# Altium schematic sheet SNS_INPUT.SchDoc: {Наименование}
size 420 x 297 mm; ApprovedBy: {Утвердил}; CheckedBy: {Проверил}; DrawnBy: {Разраб.}; DocumentNumber: АБВГ 123456.789 00; SheetNumber: 9; SheetTotal: {}; Scale: {Мш.}; PageSetup: Record=PageOptions|CenterHorizontal=False|CenterVertical=False|PrintScale=0.95|XCorrection=0.00|YCorrection=0.00|PrintKind=1|BorderSize=5000000|LeftOffset=0|BottomOffset=0|Orientation=1|PaperLength=1000|PaperWidth=1000|Scale=100|PaperSource=15|PrintQuality=600|MediaType=1|DitherType=10|PaperKind=A4|PrintScaleMode=1; ProcessInspection: {Т.контр.}; Mass: {М.}; NormInspection: {Н.контр.}; Letter1Column: {}; Letter2Column: {}; Letter3Column: {}; DocumentType: {Документ}; Rule: PcbType=ProtelPcb
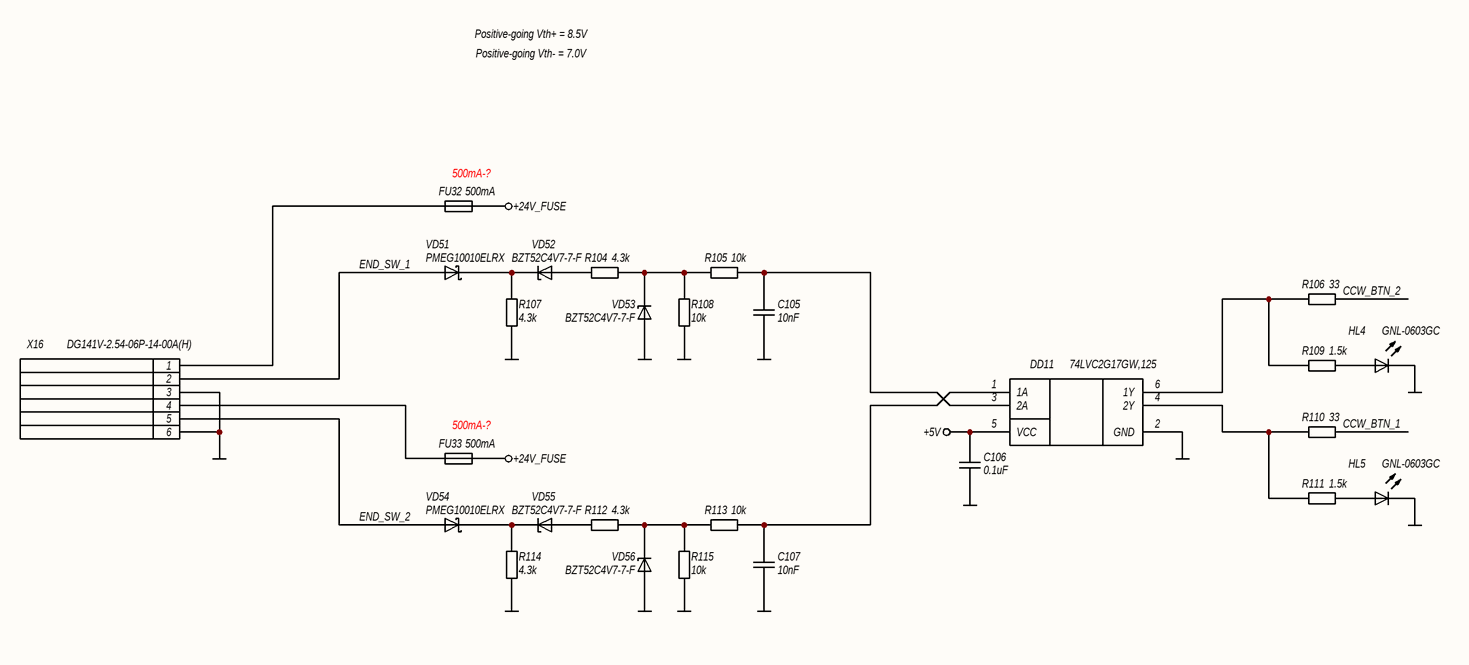
[diagram p0: SNS_INPUT.SchDoc]

## Parts
C105  10nF  [C0603N]
C106  0.1uF  [C0603N]
C107  10nF  [C0603N]
DD11  74LVC2G17GW,125  [SOT363-2]
FU32  500mA  [MF-MSMF]
FU33  500mA  [MF-MSMF]
HL4  GNL-0603GC  [LED0603]
HL5  GNL-0603GC  [LED0603]
R104  4.3k  [R1206N]
R105  10k  [R0603N]
R106  33  [R0603N]
R107  4.3k  [R1206N]
R108  10k  [R0603N]
R109  1.5k  [R0603N]
R110  33  [R0603N]
R111  1.5k  [R0603N]
R112  4.3k  [R1206N]
R113  10k  [R0603N]
R114  4.3k  [R1206N]
R115  10k  [R0603N]
VD51  PMEG10010ELRX  [SOD123W]
VD52  BZT52C4V7-7-F  [SOD123]
VD53  BZT52C4V7-7-F  [SOD123]
VD54  PMEG10010ELRX  [SOD123W]
VD55  BZT52C4V7-7-F  [SOD123]
VD56  BZT52C4V7-7-F  [SOD123]
X16  DG141V-2.54-06P-14-00A(H)  [DG141V-2.54-06P-14-00A(H)]

## Nets
+5V: C106.2 DD11.5(VCC)
+24V_FUSE: FU32.2 FU33.2
GND: C105.2 C106.1 C107.2 DD11.2(GND) HL4.1(K) HL5.1(K) R107.2 R108.2 R114.2 R115.2 VD53.2(A) VD56.2(A) X16.3 X16.6
CCW_BTN_1: R110.1
CCW_BTN_2: R106.1
END_SW_1: VD51.2(A) X16.2
END_SW_2: VD54.2(A) X16.5
NetC105_1: C105.1 DD11.3(2A) R105.1
NetC107_1: C107.1 DD11.1(1A) R113.1
NetDD11_4: DD11.4(2Y) R110.2 R111.2
NetDD11_6: DD11.6(1Y) R106.2 R109.2
NetFU32_1: FU32.1 X16.1
NetFU33_1: FU33.1 X16.4
NetHL4_2: HL4.2(A) R109.1
NetHL5_2: HL5.2(A) R111.1
NetR104_1: R104.1 R105.2 R108.1 VD53.1(K)
NetR104_2: R104.2 VD52.2(A)
NetR107_1: R107.1 VD51.1(K) VD52.1(K)
NetR112_1: R112.1 R113.2 R115.1 VD56.1(K)
NetR112_2: R112.2 VD55.2(A)
NetR114_1: R114.1 VD54.1(K) VD55.1(K)

## Notes on the sheet
- Positive-going Vth+ = 8.5V
- Positive-going Vth- = 7.0V
- (near FU32) 500mA-?
- (near FU33) 500mA-?
- Подп. и дата
- Инв. № дубл.
- Взам. инв. №
- Инв. № подл.
- Лист
- Изм.
- № докум.
- Подп.
- Дата
- Копировал
- Формат А3

## Library data of the parts
C105 C107 = CL10B103KB8NNNC: Конденсатор; Точность: 10%; Напряжение: 16V; Диэлектрик: X7R; Производитель: Samsung Electro-Mechanics; Описание: 10000 pF ±10% 50V Ceramic Capacitor X7R 0603 (1608 Metric); Корпус: 0603 (1608 Metric); Температурный диапазон: -55°C ~ 125°C; Вид монтажа: SMD; Артикул: CL10B103KB8NNNC; Номинал: 10nF; Строка для документации: https://mm.digikey.com/Volume0/opasdata/d220001/medias/docus/609/CL10B103KB8NNNC_Spec.pdf; Тип элемента: Конденсатор
C106 = CL10B104KB8NNNC: Конденсатор; Точность: 10%; Напряжение: 50V; Диэлектрик: X7R; Производитель: Samsung Electro-Mechanics; Описание: 0.1 µF ±10% 50V Ceramic Capacitor X7R 0603 (1608 Metric); Корпус: 0603 (1608 Metric); Температурный диапазон: -55°C ~ 125°C; Вид монтажа: SMD; Артикул: CL10B104KB8NNNC; Номинал: 0.1uF; Строка для документации: https://mm.digikey.com/Volume0/opasdata/d220001/medias/docus/609/CL10B104KB8NNNC_Spec.pdf; Тип элемента: Конденсатор
DD11 = 74LVC2G17GW,125: Микросхема сдвоенный триггер Шмитта; Производитель: Nexperia USA Inc.; Описание: Buffer, Non-Inverting 2 Element 1 Bit per Element Push-Pull Output 6-TSSOP; Корпус: 6-TSSOP; Температурный диапазон: -40°C ~ 125°C (TA); Вид монтажа: SMD; Артикул: 74LVC2G17GW,125; Строка для документации: https://assets.nexperia.com/documents/data-sheet/74LVC2G17.pdf; Тип элемента: Микросхема
FU32 FU33 = MF-MSMF050/40X-2: Плавкий предохранитель; Напряжение: 40V; Тип: PTC Resettable Fuse; Производитель: Bourns Inc.; Описание: Polymeric PTC Resettable Fuse 40V 500 mA Ih Surface Mount 1812 (4532 Metric), Concave; Корпус: 1812 (4532 Metric), Concave; Температурный диапазон: -40°C ~ 85°C; Вид монтажа: SMD; Артикул: MF-MSMF050/40X-2; Ток: 500mA; Строка для документации: https://www.bourns.com/docs/product-datasheets/mf-msmf.pdf; Тип элемента: Предохранитель
HL4 HL5 = GNL-0603GC: Светодиод; Прямой ток: 20mA; Напряжение: 2V; Яркость: 12mcd; Цвет: Зеленый; Длина волны: 567nm; Производитель: G-nor Electronics; Описание: Green 567nm LED Indication - Discrete 2V 0603 (1608 Metric); Корпус: 0603 (1608 Metric); Температурный диапазон: -40°C ~ 80°C; Вид монтажа: SMD; Тип элемента: Диод светоизлучающий; Артикул: GNL-0603GC; Строка для документации: https://www.g-nor.com/Uploads/Ed/file/20210517/1621223120713818.doc
R104 R107 R112 R114 = RC1206FR-074K3L: Резистор; Точность: 1%; ТКС: ±100ppm/°C; Напряжение: 75V; Производитель: YAGEO; Описание: 4.3 kOhms ±1% 0.1W, 1/10W Chip Resistor 0603 (1608 Metric) Moisture Resistant Thick Film; Корпус: 1206 (3216 Metric); Температурный диапазон: -55°C ~ 155°C; Вид монтажа: SMD; Артикул: RC1206FR-074K3L; Номинал: 4.3k; Строка для документации: https://www.yageo.com/upload/media/product/productsearch/datasheet/rchip/PYu-RC_Group_51_RoHS_L_12.pdf; Тип элемента: Резистор
R105 R108 R113 R115 = RC0603FR-0710KL: Резистор; Точность: 1%; ТКС: ±100ppm/°C; Напряжение: 75V; Производитель: YAGEO; Описание: 10 kOhms ±1% 0.1W, 1/10W Chip Resistor 0603 (1608 Metric) Moisture Resistant Thick Film; Корпус: 0603 (1608 Metric); Температурный диапазон: -55°C ~ 155°C; Вид монтажа: SMD; Артикул: RC0603FR-0710KL; Номинал: 10k; Строка для документации: https://www.yageo.com/upload/media/product/app/datasheet/rchip/pyu-rc_group_51_rohs_l.pdf; Тип элемента: Резистор
R106 R110 = RC0603FR-0733RL: Резистор; Точность: 1%; ТКС: ±100ppm/°C; Напряжение: 75V; Производитель: YAGEO; Описание: 33 Ohms ±1% 0.1W, 1/10W Chip Resistor 0603 (1608 Metric) Moisture Resistant Thick Film; Корпус: 0603 (1608 Metric); Температурный диапазон: -55°C ~ 155°C; Вид монтажа: SMD; Артикул: RC0603FR-0733RL; Номинал: 33; Строка для документации: https://www.yageo.com/upload/media/product/app/datasheet/rchip/pyu-rc_group_51_rohs_l.pdf; Тип элемента: Резистор
R109 R111 = RC0603FR-071K5L: Резистор; Точность: 1%; ТКС: ±100ppm/°C; Напряжение: 75V; Производитель: YAGEO; Описание: 1.5 kOhms ±1% 0.1W, 1/10W Chip Resistor 0603 (1608 Metric) Moisture Resistant Thick Film; Корпус: 0603 (1608 Metric); Температурный диапазон: -55°C ~ 155°C; Вид монтажа: SMD; Артикул: RC0603FR-071K5L; Номинал: 1.5k; Строка для документации: https://www.yageo.com/upload/media/product/app/datasheet/rchip/pyu-rc_group_51_rohs_l.pdf; Тип элемента: Резистор
VD51 VD54 = PMEG10010ELRX: Диод Шоттки; Прямой ток: 1A; Напряжение: 100V; Производитель: Nexperia USA Inc.; Описание: Diode 100 V 1A Surface Mount SOD-123W; Корпус: SOD-123W; Температурный диапазон: -40°C ~ 175°C; Вид монтажа: SMD; Артикул: PMEG10010ELRX; Тип: Schottky; Строка для документации: https://assets.nexperia.com/documents/data-sheet/PMEG10010ELR.pdf; Тип элемента: Диод
VD52 VD53 VD55 VD56 = BZT52C4V7-7-F: Стабилитрон; Прямой ток: 5mA; Напряжение: 4.7V; Производитель: Diodes Incorporated; Описание: Zener Diode 4.7 V 500 mW ±6% Surface Mount SOD-123; Корпус: SOD-123; Температурный диапазон: -65°C ~ 150°C; Вид монтажа: SMD; Тип элемента: Диод; Артикул: BZT52C4V7-7-F; Тип: Zener; Строка для документации: https://www.diodes.com/assets/Datasheets/ds18010.pdf
X16 = DG141V-2.54-06P-14-00A(H): Разъем, 6 контактов; Тип разъема: Push-Button terminal block; Количество контактов: 6; Шаг контактов: 2.54mm; Ток: 2A; Напряжение: 150V; Производитель: Degson Electronics; Описание: 6 Position Wire to Board Terminal Block Vertical with Board 0.100" (2.54mm) Through Hole; Температурный диапазон: -40°C ~ 105°C; Вид монтажа: Through Hole; Артикул: DG141V-2.54-06P-14-00A(H); Строка для документации: https://static.chipdip.ru/lib/874/DOC000874680.pdf; Тип элемента: Разъем